# Altium schematic sheet 1_ESP_batt_shield-Power.SchDoc
size A4; SheetNumber: 2; SheetTotal: 3
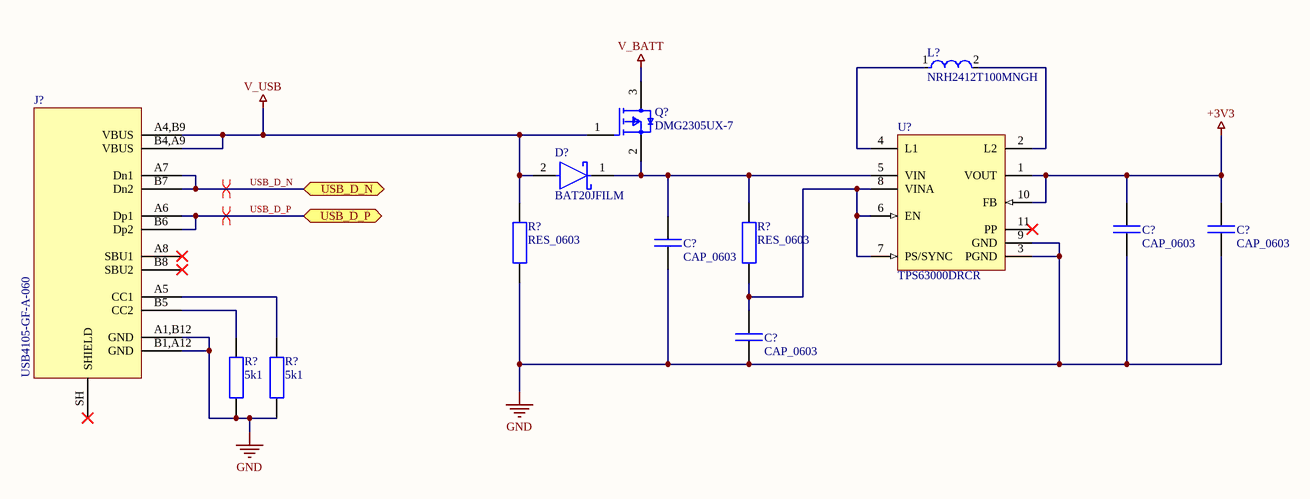
[diagram p0: 1_ESP_batt_shield-Power.SchDoc]

## Parts
(Parts that share a designator on the sheet are numbered #1, #2 ... from top to bottom, then left to right.)
C?#1  CAP_0603  [CAP_0603]
C?#2  CAP_0603  [CAP_0603]
C?#3  CAP_0603  [CAP_0603]
C?#4  CAP_0603  [CAP_0603]
D?  BAT20JFILM  [FP-BAT20JFILM-MFG]
J?  USB4105-GF-A-060  [GCT_USB4105-GF-A-060]
L?  NRH2412T100MNGH  [FP-NRH2412-MFG]
Q?  DMG2305UX-7  [FP-SOT23-IPC_B]
R?#1  RES_0603  [RES_0603]
R?#2  RES_0603  [RES_0603]
R?#3  5k1  [RES_0603]
R?#4  5k1  [RES_0603]
U?  TPS63000DRCR  [DRC0010J_V]

## Ports
USB_D_N (bidir), USB_D_P (bidir)

## Nets
+3V3: C?#1.2 C?#2.2 U?.1(VOUT) U?.10(FB)
GND: C?#1.1 C?#2.1 C?#3.1 C?#4.1 J?.A1,B12(GND) J?.B1,A12(GND) R?#1.1 R?#3.1 R?#4.1 U?.3(PGND) U?.9(GND)
V_BATT: Q?.3(DRAIN)
V_USB: D?.2(A) J?.A4,B9(VBUS) J?.B4,A9(VBUS) Q?.1(GATE) R?#1.2
USB_D_N: J?.A7(Dn1) J?.B7(Dn2) ; port USB_D_N
USB_D_P: J?.A6(Dp1) J?.B6(Dp2) ; port USB_D_P
NetC?#3_2: C?#3.2 D?.1(K) Q?.2(SOURCE) R?#2.2 U?.5(VIN)
NetC?#4_2: C?#4.2 R?#2.1 U?.6(EN) U?.7(PS/SYNC) U?.8(VINA)
NetJ?_A5: J?.A5(CC1) R?#4.2
NetJ?_B5: J?.B5(CC2) R?#3.2
NetL?_1: L?.1 U?.4(L1)
NetL?_2: L?.2 U?.2(L2)

Not connected (* = marked no-connect by the designer): J? A8(SBU1)* B8(SBU2)* SH(SHIELD)*; U? 11(PP)*

## Layout directives
differential pair: USB_D_N, USB_D_P

## Library data of the parts
D? = CMP-12187-000030-1: DIODE SCHOTTKY 23V 1A SOD323; Polarity: Standard; Element Configuration: Single; Capacitance: 30pF; Forward Voltage: 620mV; Max Surge Current: 5A; Peak Reverse Current: 12uA; Packaging: Tape and Reel; Weight: 0.01lb; Output Current: 1A; Lead Free: Lead Free; Forward Current: 1A; Mount: Surface Mount; Max Reverse Voltage (DC): 23V; Average Rectified Current: 1A; Max Operating Temperature: 150°C; Max Forward Surge Current (Ifsm): 5A; REACH SVHC: No SVHC; Current Rating: 1A; Length: 1.8mm; Radiation Hardening: No; Max Reverse Leakage Current: 12uA; Voltage Rating (DC): 23V; Height: 1.03mm; Peak Non-Repetitive Surge Current: 5A; Max Repetitive Reverse Voltage (Vrrm): 23V; Min Operating Temperature: -65°C; Number of Pins: 2; Width: 1.35mm; Package Quantity: 1
J? = USB4105-GF-A-060: This is 16pin USB-C connector; pin to pad: A1,B12>A1_B12 A4,B9>A4_B9 B1,A12>B1_A12 B4,A9>B4_A9
L? = CMP-14484-000582-1: Shielded Wirewound Inductor 10uH 20% 0.51A 0.72Ω SMD; DC Resistance (DCR): 600mR; Current Rating: 450mA; Saturation Current: 810mA; Core Material: Ferrite; Test Frequency: 100kHz; Self Resonant Frequency: 29MHz; Termination: SMD/SMT; Shielding: Shielded; Height - Seated (Max): 0.047inch; Case/Package: Nonstandard; Tolerance: 20%; Height: 1.2mm; Package Quantity: 2500; Mount: Surface Mount; Min Operating Temperature: -25°C; Inductance: 10uH; Width: 0.095inch; Length: 0.095inch; RoHS Compliant: Yes; Max DC Current: 810mA; Packaging: Tape and Reel; Max Operating Temperature: 120°C; Halogen Free: Halogen Free
Q? = CMP-1693-00002-4: MOSFET P-CH 20V 4.2A SOT23; Turn-On Delay Time: 10.8ns; Turn-Off Delay Time: 79.3ns; Threshold Voltage: -900mV; Rise Time: 13.7ns; Gate to Source Voltage (Vgs): 8V; Rds On Max: 52mR; Element Configuration: Single; Fall Time: 34.7ns; Max Power Dissipation: 1.4W; Drain to Source Resistance: 200mR; Number of Channels: 1; Input Capacitance: 808pF; Lead Free: Lead Free; Number of Pins: 3; Length: 3mm; Continuous Drain Current (ID): 4.2A; Contact Plating: Tin; Mount: Surface Mount; Weight: 0.000282oz; Min Operating Temperature: -55°C; Package Quantity: 3000; Drain to Source Voltage (Vdss): 20V; On-State Resistance: 52MR; Max Operating Temperature: 150°C; Height: 1.1mm; REACH SVHC: No SVHC; Packaging: Tape and Reel; Radiation Hardening: No; Case/Package: SOT-23; Width: 1.4mm
R?#3 R?#4 = RES_0603
U? = CMP-0345-00001-2: Buck-Boost Voltage Converter with 1.8 to 5.5 V Input and 1.2 to 5.5 V Output, -40 to 85 degC, 10-Pin SON (DRC), Green (RoHS & no Sb/Br); Manufacturer: Texas Instruments; Vout(Max)(V): 5.5; Synchronous Rectification: TRUE; SubFamily: Buck-Boost Regulator; Vin(Min)(V): 1.8; Iq(Typ)(mA): 0.04; Iout(Max)(A): 1.2; Regulated Outputs(#): 1; Switching Frequency(Max)(kHz): 1500; ComponentLink1Description: Datasheet; Mounting Technology: Surface Mount; DatasheetVersion: SLVS520B; Eco-Plan: Green (RoHS & no Sb/Br); PackageVersion: revL, Sep-2011; PackageDescription: 10-Pin Plastic Small Outline No-Lead, 3 x 3 x 1 mm Body, 0.5 mm Pitch, Exposed Pad; Vout(Min)(V): 1.2; Vin(Max)(V): 5.5; Topology: Buck-Boost; Dynamic Voltage Scaling: TRUE; ComponentLink1URL: http://www.ti.com/general/docs/lit/getliterature.tsp?genericPartNumber=TPS63000&fileType=pdf; PartNumber: TPS63000DRCR; ComponentLink2URL: http://www.ti.com/litv/pdf/mpds117k; PackageReference: DRC0010J; ComponentLink2Description: Package Specification